# EAGLE design test_strip_v0.1_r1.1 (EAGLE 7.7.0)
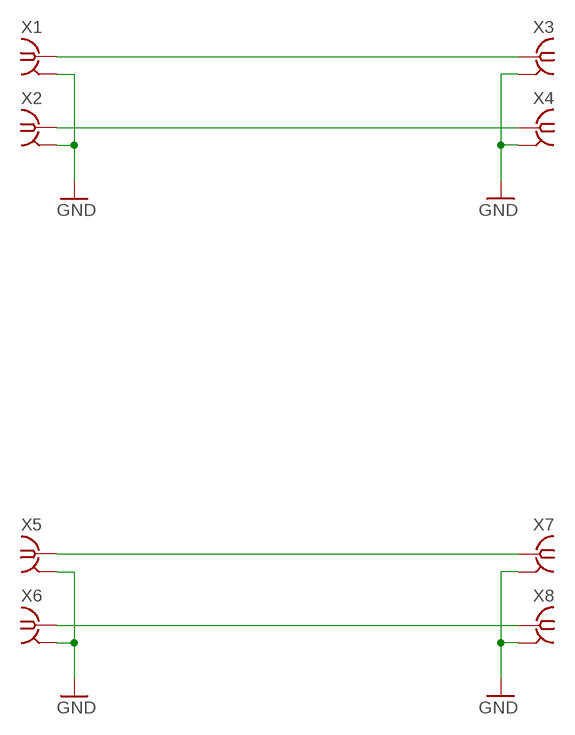
[diagram p0: schematic, sheet 1]

## Parts
X1  BU-SMA-E-ND  [SMA-EDGE_ND]
X2  BU-SMA-E-ND  [SMA-EDGE_ND]
X3  BU-SMA-E-ND  [SMA-EDGE_ND]
X4  BU-SMA-E-ND  [SMA-EDGE_ND]
X5  BU-SMA-E-ND  [SMA-EDGE_ND]
X6  BU-SMA-E-ND  [SMA-EDGE_ND]
X7  BU-SMA-E-ND  [SMA-EDGE_ND]
X8  BU-SMA-E-ND  [SMA-EDGE_ND]

## Nets
GND: X1.2@3 X1.2@4 X2.2@3 X2.2@4 X3.2@3 X3.2@4 X4.2@3 X4.2@4 X5.2@3 X5.2@4 X6.2@3 X6.2@4 X7.2@3 X7.2@4 X8.2@3 X8.2@4
SIGA_N: X2.1 X4.1
SIGA_P: X1.1 X3.1
SIGB_N: X6.1 X8.1
SIGB_P: X5.1 X7.1

## Library data of the parts
X1-X8 = sma:BU-SMA-E

## Net classes
0 default: width 0.152 mm, drill 0.203 mm, clearance 0.152 mm

## Board
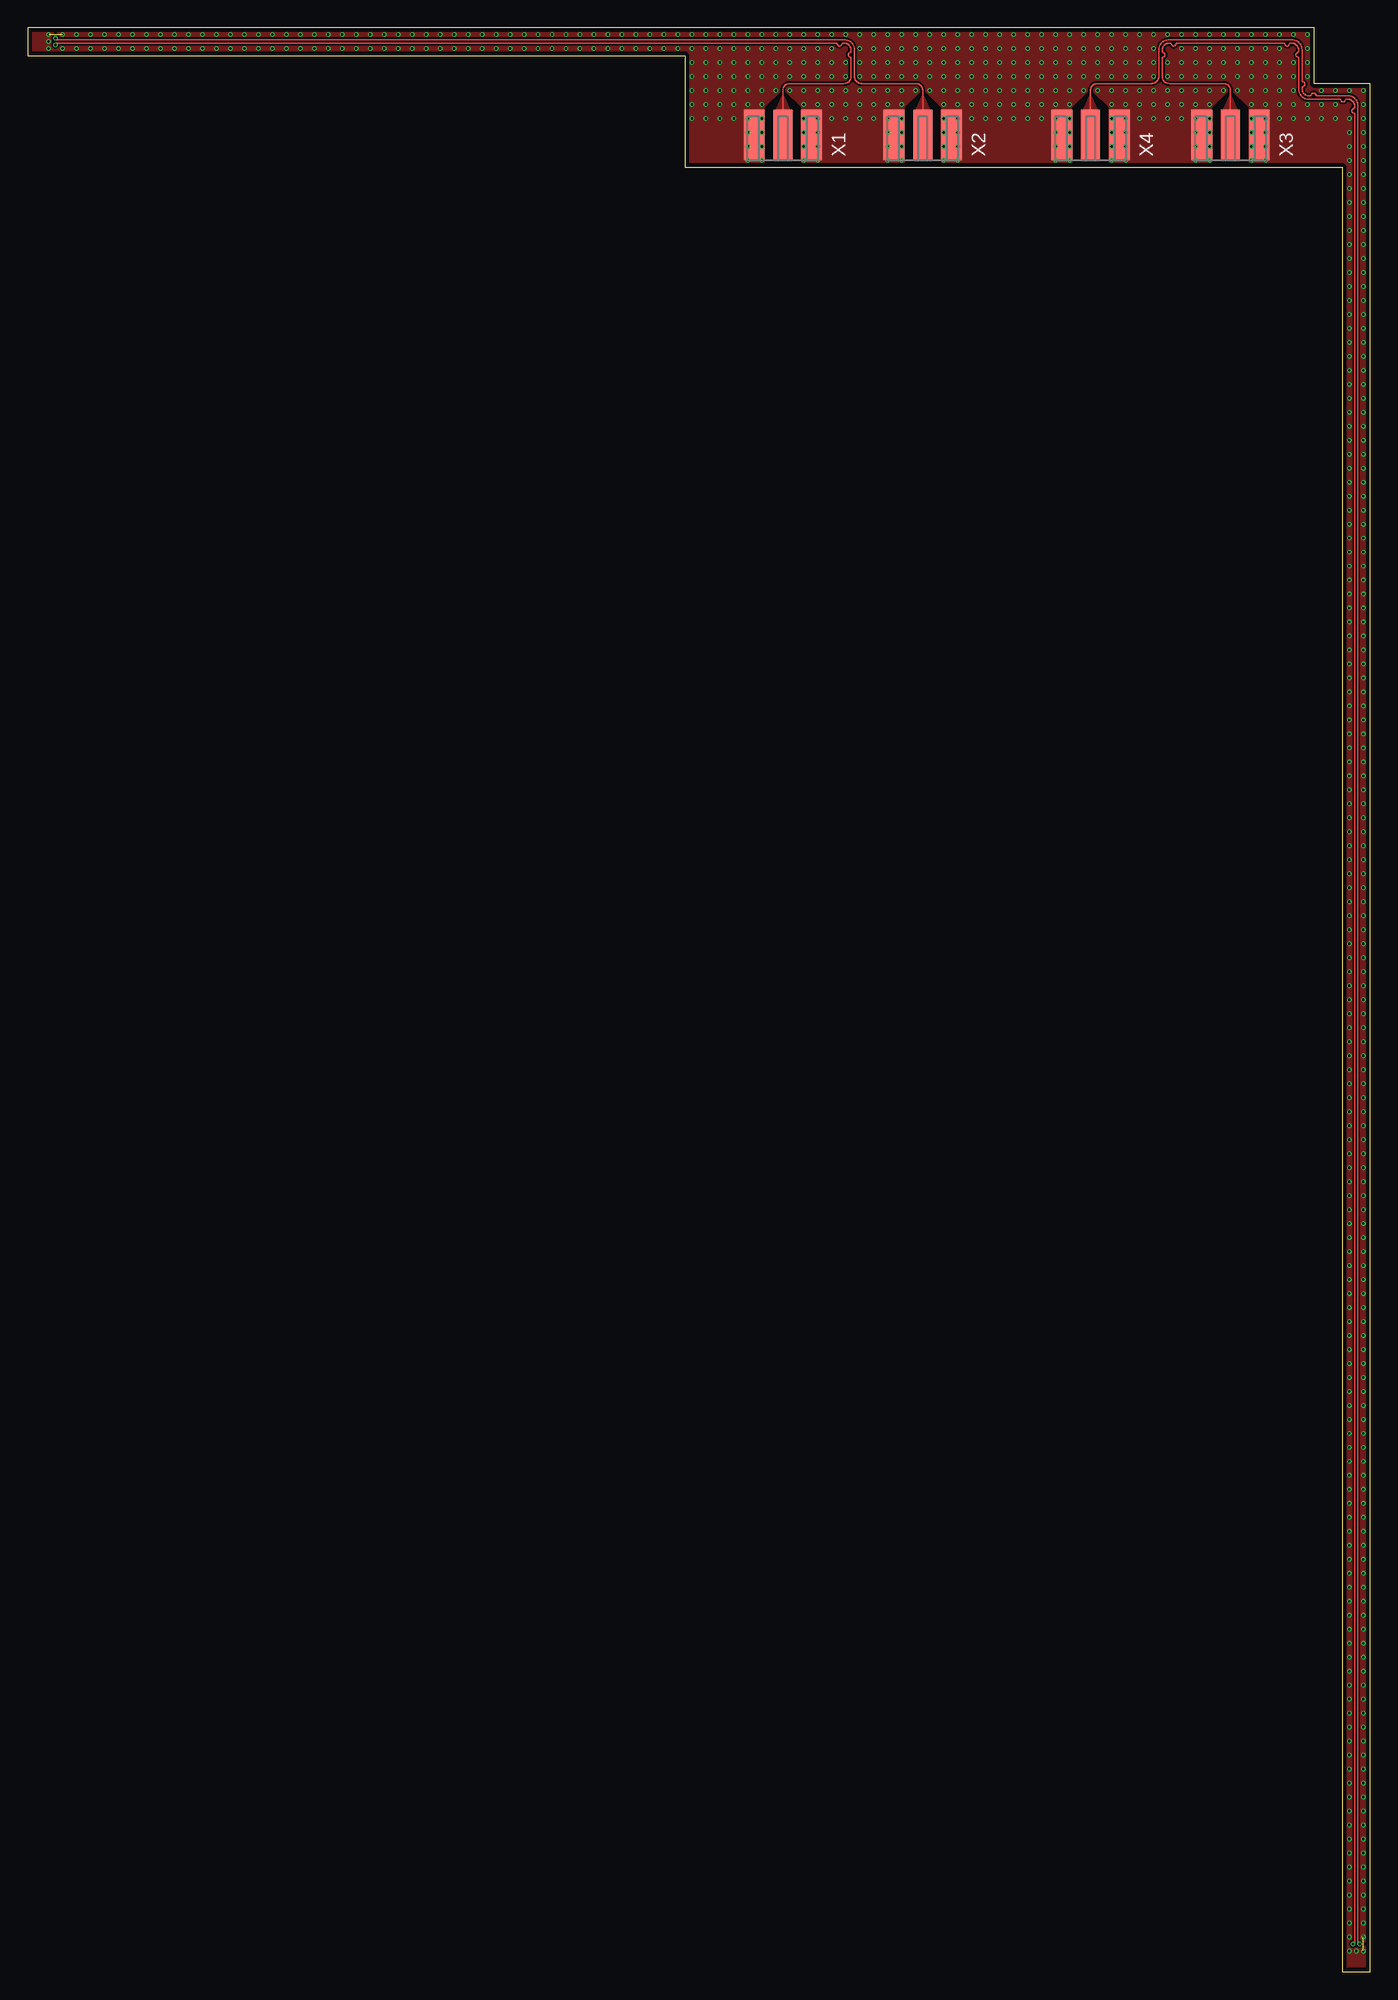
[diagram p1: board, top side]
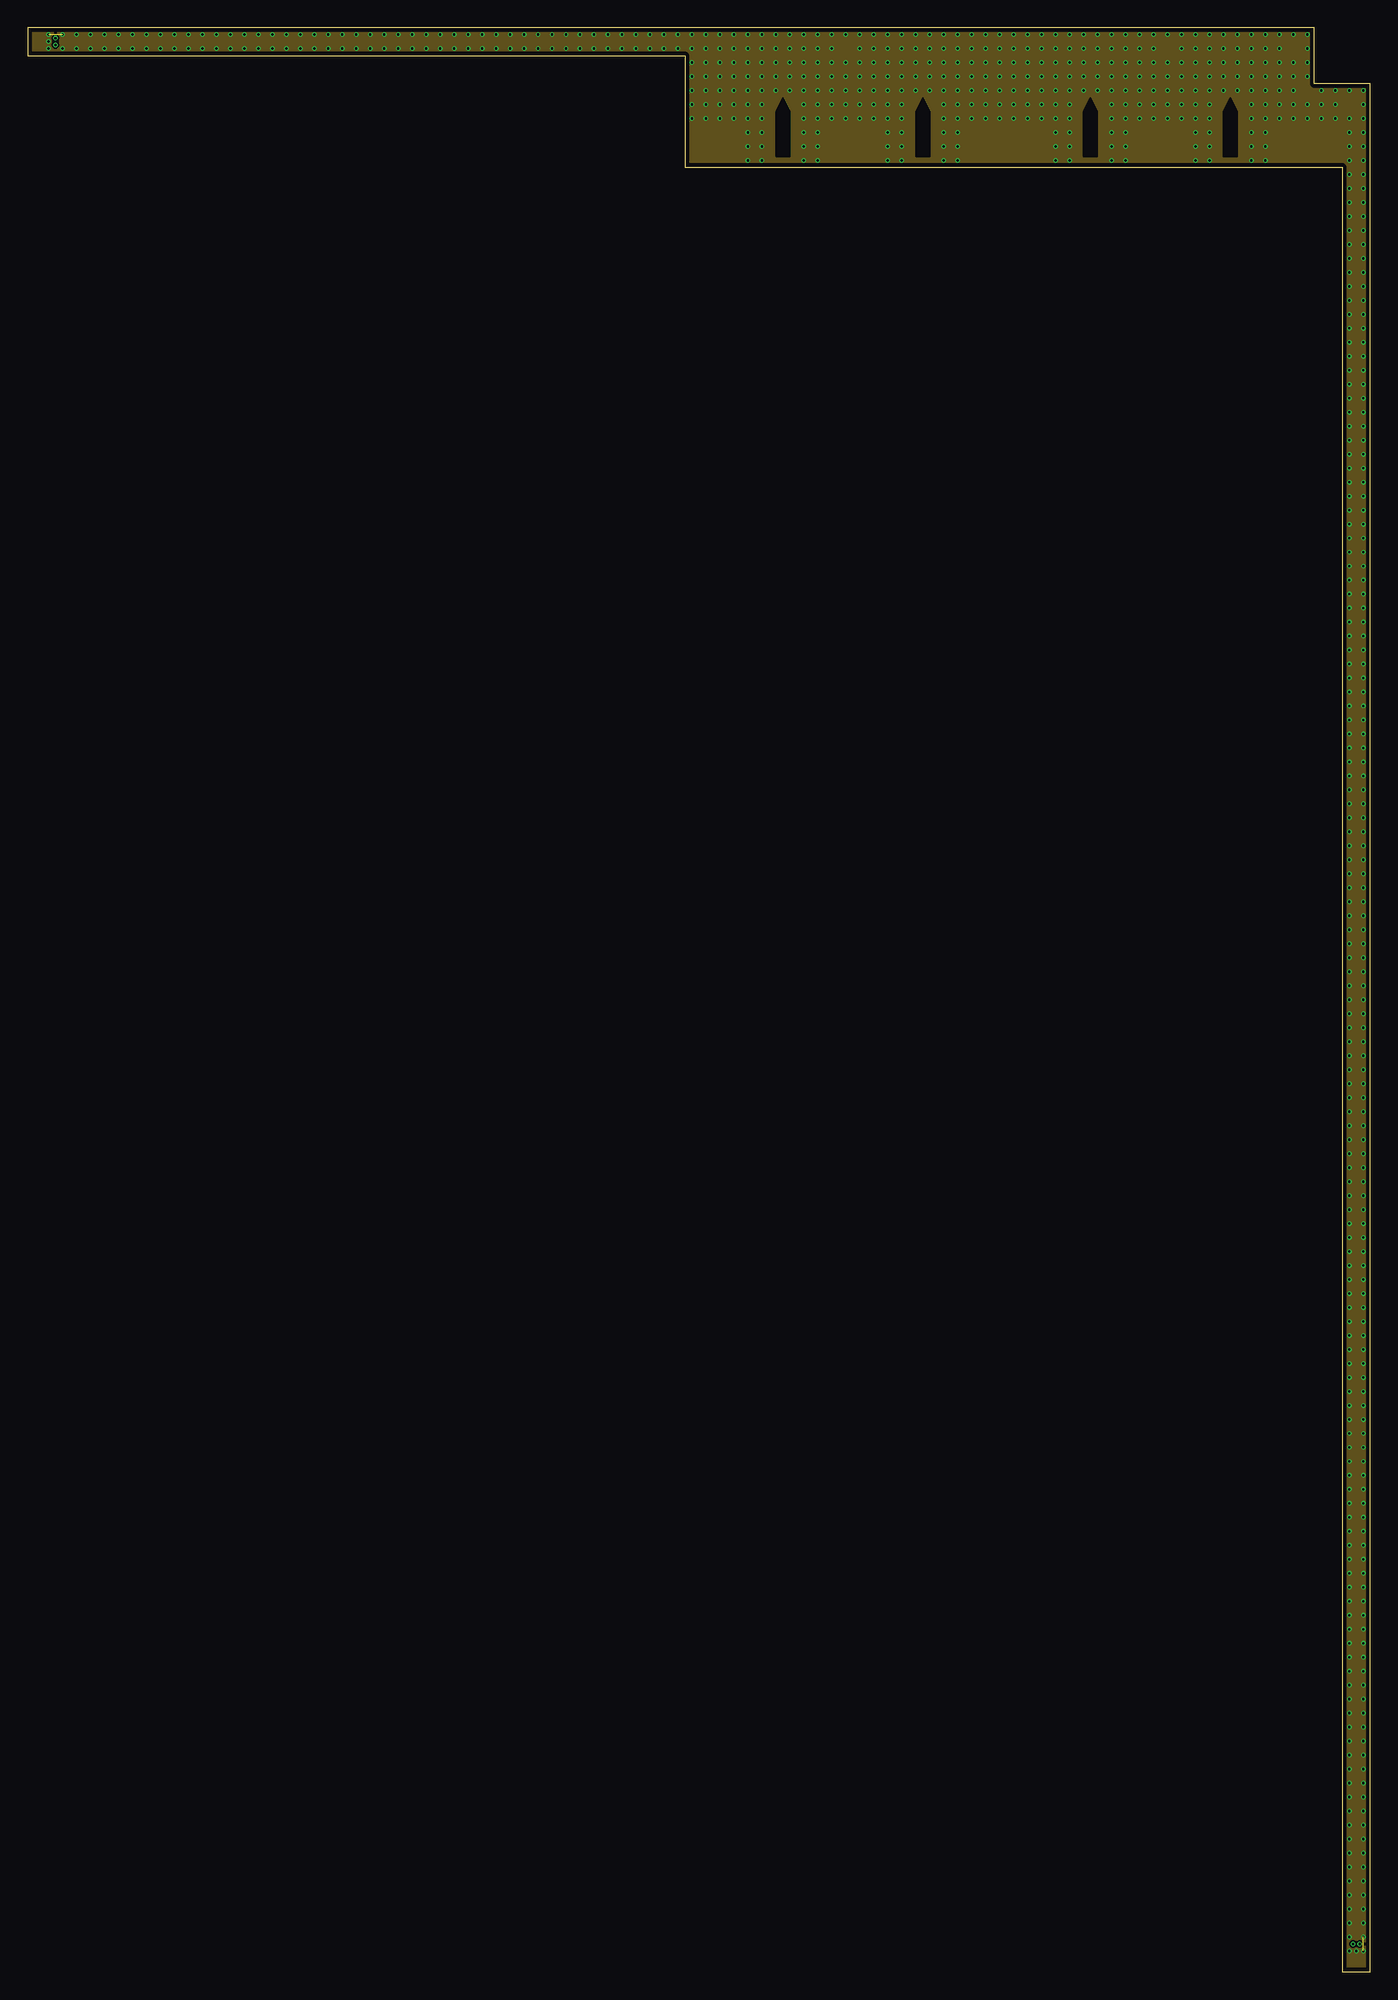
[diagram p2: board, inner layer Route2]
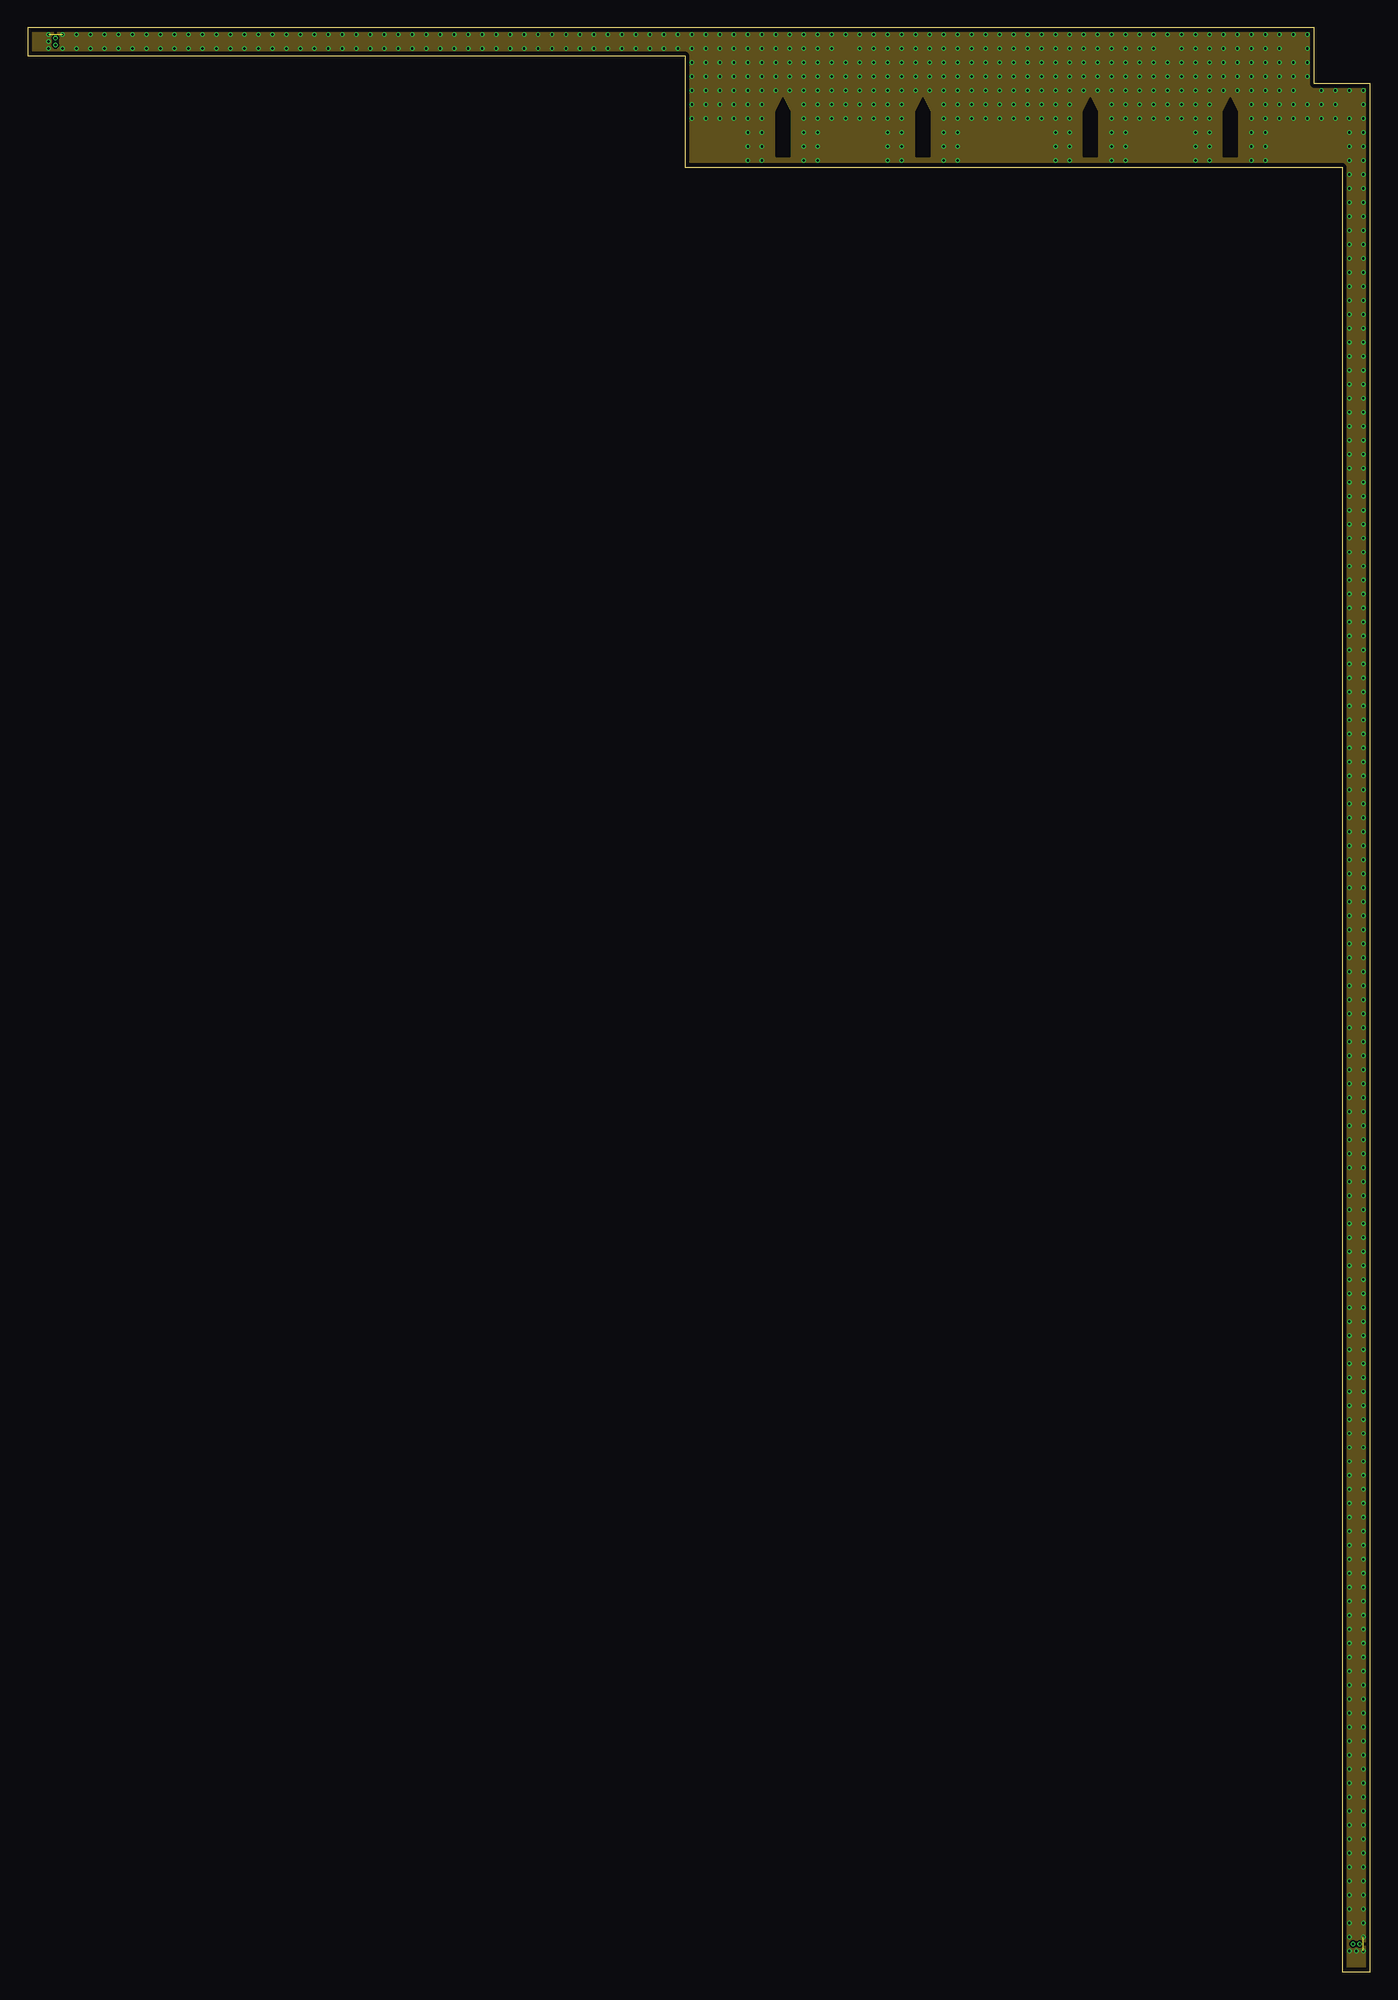
[diagram p3: board, inner layer Route15]
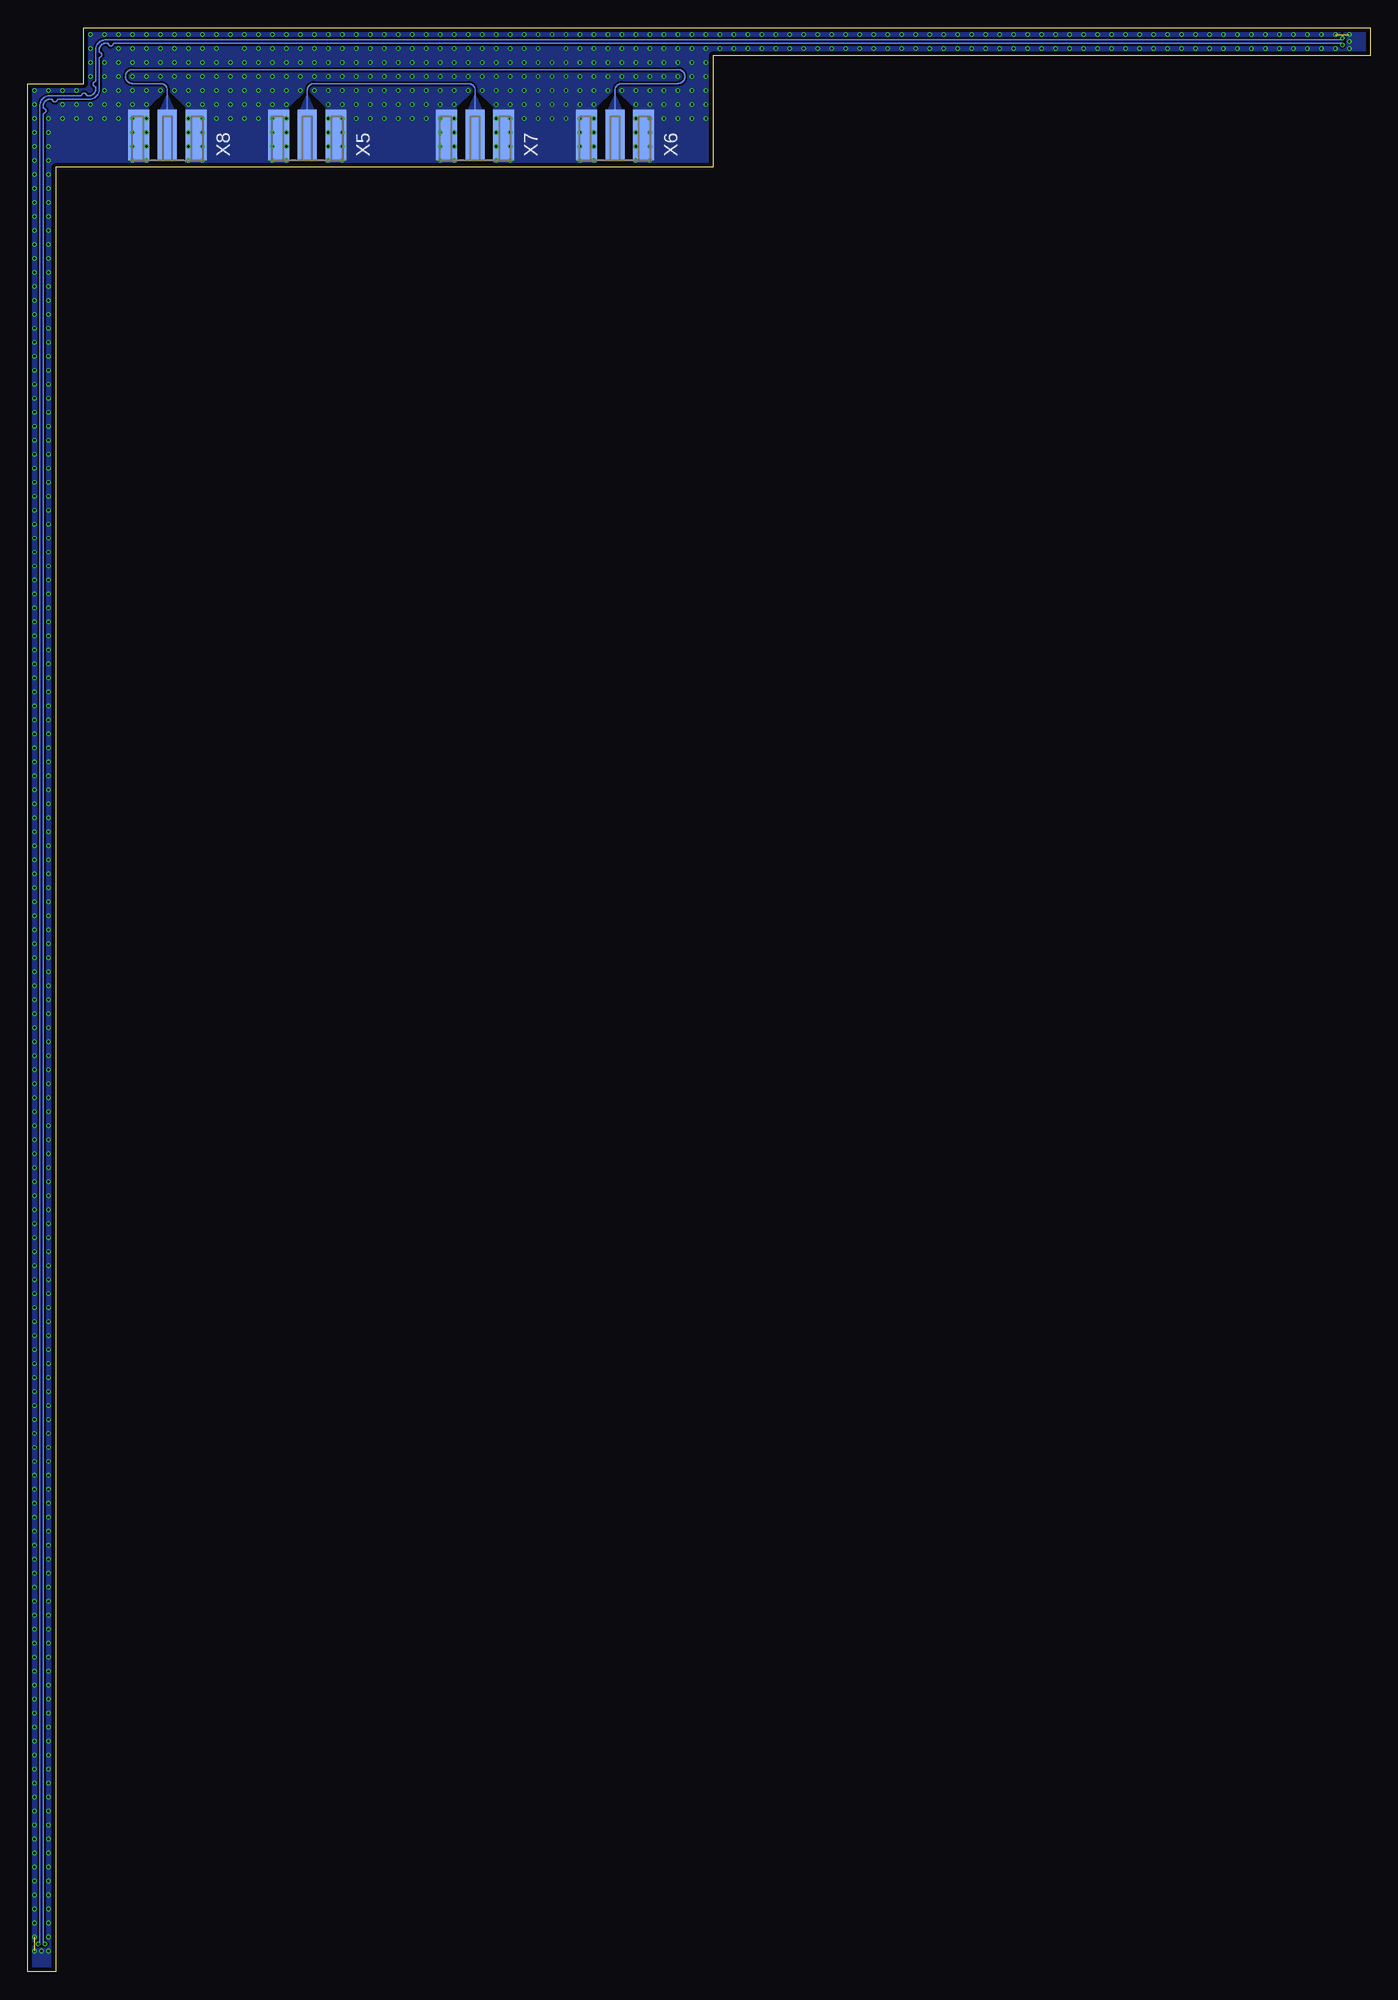
[diagram p4: board, bottom side, seen from below]

Size 121.92 x 176.53 mm. Coordinates in mm from the lower left corner, seen from the top.
Outline: 0,176.53 0,173.99 59.69,173.99 59.69,163.83 119.38,163.83 119.38,0 121.92,0 121.92,171.45 116.84,171.45 116.84,176.53 0,176.53
Copper layers (1*2*15*16): Top 0.035559375mm / dielectric 0.17018125mm / Route2 0.01778125mm / dielectric 47mil / Route15 0.01778125mm / dielectric 0.17018125mm / Bottom 0.035559375mm
Design rules "OSHPark-4layer-tuned *": minimum track width 5mil, minimum drill 10mil, track to track 5mil, track to pad 5mil, pad to pad 5mil, via to via 5mil, smd to smd 5mil, copper to edge 15mil, drill to drill 6mil, minimum pad ring 4mil, minimum via ring 4mil, stop-mask expansion 2mil, vias tented up to drill 10mil, thermal gap 6mil

### Footprints (pad centres in the part's own frame; a part is rotated, then mirrored left to right if it is on the bottom)
SMA-EDGE_ND = smd 4.6 x 1.73: 1 -2.3,0 | smd 4.6 x 1.9: 2@3 -2.3,-2.6; 2@4 -2.3,2.6

### Placement (x,y rotation side)
X1  68.58,164.46 270 top
X2  81.28,164.46 270 top
X3  109.22,164.46 270 top
X4  96.52,164.46 270 top
X5  96.52,164.46 270 bottom
X6  68.58,164.46 270 bottom
X7  81.28,164.46 270 bottom
X8  109.22,164.46 270 bottom

### Tracks (layer width: path | path; a pad name or v marks a point on that pad's centre or on a via)
GND  (via drill 0.2)  (2 unrouted)
  other vias: 3.17,175.89 3.17,174.62 4.45,174.62 5.72,174.62 6.98,174.62 6.98,175.89 5.72,175.89 4.45,175.89 8.25,175.89 8.25,174.62 9.53,174.62 10.8,174.62 12.06,174.62 12.06,175.89 10.8,175.89 9.53,175.89 13.33,175.89 13.33,174.62 14.61,174.62 15.88,174.62 17.14,174.62 17.14,175.89 15.88,175.89 14.61,175.89 18.42,175.89 18.42,174.62 19.69,174.62 20.95,174.62 22.22,174.62 22.22,175.89 20.95,175.89 19.69,175.89 23.5,175.89 23.5,174.62 24.77,174.62 26.04,174.62 27.3,174.62 27.3,175.89 26.04,175.89 24.77,175.89 28.58,175.89 28.58,174.62 29.84,174.62 31.12,174.62 32.38,174.62 32.38,175.89 31.12,175.89 29.84,175.89 33.66,175.89 33.66,174.62 34.92,174.62 36.2,174.62 37.47,174.62 37.47,175.89 36.2,175.89 34.92,175.89 38.73,175.89 38.73,174.62 40.01,174.62 41.27,174.62 42.55,174.62 42.55,175.89 41.27,175.89 40.01,175.89 43.81,175.89 43.81,174.62 45.09,174.62 46.36,174.62 47.62,174.62 47.62,175.89 46.36,175.89 45.09,175.89 48.9,175.89 48.9,174.62 50.16,174.62 51.44,174.62 52.7,174.62 52.7,175.89 51.44,175.89 50.16,175.89 53.98,175.89 53.98,174.62 55.24,174.62 56.52,174.62 57.78,174.62 57.78,175.89 56.52,175.89 55.24,175.89 59.05,175.89 59.05,174.62 60.33,174.62 61.59,174.62 62.87,174.62 62.87,175.89 61.59,175.89 60.33,175.89 1.91,175.89 1.91,174.62 1.91,175.26 121.28,132.71 120.02,132.71 120.02,133.98 121.28,133.98 121.28,135.25 121.28,136.52 121.28,137.79 120.02,137.79 120.02,136.52 120.02,135.25 120.02,139.06 121.28,139.06 121.28,140.33 121.28,141.6 121.28,142.88 120.02,142.88 120.02,141.6 120.02,140.33 120.02,144.14 121.28,144.14 121.28,145.41 121.28,146.69 121.28,147.95 120.02,147.95 120.02,146.69 120.02,145.41 120.02,149.22 121.28,149.22 121.28,150.49 121.28,151.76 121.28,153.03 120.02,153.03 120.02,151.76 120.02,150.49 120.02,154.3 121.28,154.3 121.28,155.57 121.28,156.84 121.28,158.11 120.02,158.11 120.02,156.84 120.02,155.57 120.02,159.38 121.28,159.38 121.28,160.65 121.28,161.92 121.28,163.19 120.02,163.19 120.02,161.92 120.02,160.65 120.02,164.46 121.28,164.46 121.28,165.73 121.28,167 121.28,168.27 120.02,168.27 120.02,167 120.02,165.73 120.02,71.75 121.28,71.75 121.28,73.02 121.28,74.29 121.28,75.56 120.02,75.56 120.02,74.29 120.02,73.02 120.02,76.83 121.28,76.83 121.28,78.1 121.28,79.37 121.28,80.64 120.02,80.64 120.02,79.37 120.02,78.1 120.02,81.91 121.28,81.91 121.28,83.18 121.28,84.45 121.28,85.72 120.02,85.72 120.02,84.45 120.02,83.18 120.02,86.99 121.28,86.99 121.28,88.26 121.28,89.53 121.28,90.8 120.02,90.8 120.02,89.53 120.02,88.26 120.02,92.07 121.28,92.07 121.28,93.34 121.28,94.61 121.28,95.88 120.02,95.88 120.02,94.61 120.02,93.34 120.02,97.15 121.28,97.15 121.28,98.42 121.28,99.69 121.28,100.96 120.02,100.96 120.02,99.69 120.02,98.42 120.02,102.23 121.28,102.23 121.28,103.5 121.28,104.77 121.28,106.04 120.02,106.04 120.02,104.77 120.02,103.5 120.02,107.31 121.28,107.31 121.28,108.58 121.28,109.85 121.28,111.12 120.02,111.12 120.02,109.85 120.02,108.58 120.02,112.39 121.28,112.39 121.28,113.66 121.28,114.93 121.28,116.2 120.02,116.2 120.02,114.93 120.02,113.66 120.02,117.47 121.28,117.47 121.28,118.74 121.28,120.01 121.28,121.28 120.02,121.28 120.02,120.01 120.02,118.74 120.02,122.55 121.28,122.55 121.28,123.82 121.28,125.09 121.28,126.36 120.02,126.36 120.02,125.09 120.02,123.82 120.02,127.63 121.28,127.63 121.28,128.9 121.28,130.17 121.28,131.44 120.02,131.44 120.02,130.17 120.02,128.9 120.02,3.17 121.28,3.17 121.28,12.06 121.28,13.33 121.28,14.6 120.02,14.6 120.02,13.33 120.02,12.06 120.02,15.88 121.28,15.88 121.28,17.14 121.28,18.41 121.28,19.68 120.02,19.68 120.02,18.41 120.02,17.14 120.02,20.95 121.28,20.95 121.28,22.22 121.28,23.49 121.28,24.76 120.02,24.76 120.02,23.49 120.02,22.22 120.02,26.03 121.28,26.03 121.28,27.3 121.28,28.57 121.28,29.84 120.02,29.84 120.02,28.57 120.02,27.3 120.02,31.11 121.28,31.11 121.28,32.38 121.28,33.65 121.28,34.92 120.02,34.92 120.02,33.65 120.02,32.38 120.02,36.19 121.28,36.19 121.28,37.46 121.28,38.73 121.28,40 120.02,40 120.02,38.73 120.02,37.46 120.02,41.27 121.28,41.27 121.28,42.54 121.28,43.81 121.28,45.08 120.02,45.08 120.02,43.81 120.02,42.54 120.02,46.35 121.28,46.35 121.28,47.62 121.28,48.89 121.28,50.16 120.02,50.16 120.02,48.89 120.02,47.62 120.02,51.43 121.28,51.43 121.28,52.7 121.28,53.97 121.28,55.24 120.02,55.24 120.02,53.97 120.02,52.7 120.02,56.51 121.28,56.51 121.28,57.78 121.28,59.05 121.28,60.32 120.02,60.32 120.02,59.05 120.02,57.78 120.02,61.59 121.28,61.59 121.28,62.86 121.28,64.13 121.28,65.4 120.02,65.4 120.02,64.13 120.02,62.86 120.02,66.67 121.28,66.67 121.28,67.94 121.28,69.21 121.28,70.48 120.02,70.48 120.02,69.21 120.02,67.94 120.02,1.9 121.28,1.9 120.65,1.9 106.05,174.62 106.05,175.89 107.31,175.89 107.31,174.62 108.59,174.62 109.86,174.62 111.12,174.62 111.12,175.89 109.86,175.89 108.59,175.89 112.39,175.89 112.39,174.62 113.66,174.62 116.2,174.62 116.2,175.89 114.94,175.89 113.66,175.89 114.94,173.35 114.94,172.08 114.94,170.81 114.94,169.54 117.47,169.54 116.2,169.54 118.75,169.54 118.75,170.81 117.47,170.81 116.2,173.35 116.2,172.08 64.14,174.62 64.14,175.89 65.41,175.89 65.41,174.62 66.67,174.62 67.94,174.62 69.22,174.62 69.22,175.89 67.94,175.89 66.67,175.89 70.48,175.89 70.48,174.62 71.75,174.62 73.03,174.62 74.3,175.89 73.03,175.89 71.75,175.89 75.56,175.89 75.56,174.62 76.84,174.62 78.11,174.62 79.38,174.62 79.38,175.89 78.11,175.89 76.84,175.89 80.64,175.89 80.64,174.62 81.92,174.62 83.19,174.62 84.45,174.62 84.45,175.89 83.19,175.89 81.92,175.89 85.72,175.89 85.72,174.62 87,174.62 88.27,174.62 89.53,174.62 89.53,175.89 88.27,175.89 87,175.89 90.81,175.89 90.81,174.62 92.08,174.62 93.34,174.62 94.61,174.62 94.61,175.89 93.34,175.89 92.08,175.89 95.89,175.89 95.89,174.62 97.16,174.62 98.42,174.62 99.69,174.62 99.69,175.89 98.42,175.89 97.16,175.89 100.97,175.89 100.97,174.62 102.23,174.62 104.78,174.62 104.78,175.89 103.5,175.89 102.23,175.89 121.28,169.54 121.28,170.81 120.02,170.81 95.89,172.08 97.16,172.08 97.16,173.35 95.89,173.35 98.42,173.35 98.42,172.08 99.69,172.08 100.97,172.08 102.23,173.35 100.97,173.35 99.69,173.35 103.5,173.35 103.5,172.08 104.78,172.08 106.05,172.08 107.31,172.08 107.31,173.35 106.05,173.35 104.78,173.35 108.59,173.35 109.86,172.08 109.86,173.35 70.48,170.81 71.75,170.81 73.03,170.81 75.56,170.81 76.84,170.81 78.11,170.81 79.38,170.81 67.94,172.08 69.22,173.35 67.94,173.35 70.48,173.35 70.48,172.08 71.75,172.08 73.03,172.08 74.3,173.35 73.03,173.35 71.75,173.35 75.56,173.35 75.56,172.08 76.84,172.08 78.11,172.08 79.38,172.08 79.38,173.35 78.11,173.35 76.84,173.35 80.64,173.35 80.64,172.08 81.92,172.08 81.92,173.35 98.42,170.81 99.69,170.81 100.97,170.81 103.5,170.81 104.78,170.81 106.05,170.81 107.31,170.81 111.12,173.35 112.39,173.35 113.66,173.35 113.66,172.08 113.66,170.81 112.39,170.81 111.12,170.81 111.12,172.08 112.39,172.08 66.67,173.35 65.41,173.35 64.14,173.35 62.87,173.35 61.59,173.35 61.59,172.08 61.59,170.81 62.87,170.81 64.14,170.81 65.41,170.81 66.67,170.81 66.67,172.08 65.41,172.08 64.14,172.08 62.87,172.08 66.67,169.54 66.67,168.27 66.67,167 66.67,165.73 70.48,165.73 70.48,167 70.48,168.27 70.48,169.54 79.38,169.54 79.38,168.27 79.38,167 79.38,165.73 83.19,170.81 83.19,169.54 83.19,168.27 83.19,167 83.19,165.73 81.92,170.81 80.64,170.81 69.22,170.81 67.94,170.81 74.3,172.08 74.3,170.81 83.19,172.08 83.19,173.35 95.89,170.81 97.16,170.81 94.61,173.35 94.61,172.08 94.61,170.81 94.61,169.54 94.61,168.27 94.61,167 94.61,165.73 98.42,169.54 98.42,168.27 98.42,167 98.42,165.73 99.69,169.54 99.69,168.27 99.69,167 99.69,165.73 93.34,173.35 93.34,172.08 93.34,170.81 93.34,168.27 93.34,169.54 93.34,167 93.34,165.73 65.41,169.54 65.41,168.27 65.41,167 65.41,165.73 65.41,164.46 66.67,164.46 70.48,164.46 71.75,164.46 71.75,165.73 71.75,167 71.75,168.27 71.75,169.54 78.11,164.46 79.38,164.46 78.11,165.73 78.11,167 78.11,168.27 78.11,169.54 83.19,164.46 84.45,164.46 84.45,165.73 84.45,167 84.45,168.27 84.45,169.54 84.45,170.81 84.45,172.08 84.45,173.35 94.61,164.46 93.34,164.46 98.42,164.46 99.69,164.46 107.31,169.54 107.31,168.27 107.31,167 107.31,165.73 107.31,164.46 106.05,164.46 106.05,165.73 106.05,167 106.05,168.27 106.05,169.54 108.59,170.81 109.86,170.81 111.12,169.54 111.12,167 111.12,168.27 111.12,165.73 111.12,164.46 112.39,164.46 112.39,165.73 112.39,167 112.39,168.27 112.39,169.54 102.23,172.08 69.22,172.08 92.08,172.08 90.81,172.08 89.53,172.08 85.72,172.08 87,172.08 88.27,172.08 85.72,173.35 87,173.35 88.27,173.35 92.08,173.35 90.81,173.35 89.53,173.35 92.08,170.81 90.81,170.81 89.53,170.81 85.72,170.81 87,170.81 88.27,170.81 102.23,170.81 108.59,172.08 61.59,169.54 61.59,168.27 60.33,173.35 60.33,172.08 60.33,170.81 60.33,169.54 60.33,168.27 62.87,168.27 64.14,168.27 62.87,169.54 64.14,169.54 73.03,169.54 73.03,168.27 74.3,168.27 75.56,168.27 76.84,168.27 74.3,169.54 75.56,169.54 76.84,169.54 85.72,169.54 85.72,168.27 87,168.27 87,169.54 88.27,169.54 88.27,168.27 89.53,168.27 89.53,169.54 90.81,169.54 90.81,168.27 92.08,168.27 92.08,169.54 100.97,169.54 100.97,168.27 102.23,168.27 102.23,169.54 103.5,169.54 103.5,168.27 104.78,169.54 104.78,168.27 113.66,168.27 113.66,169.54 114.94,168.27 116.2,168.27 117.47,168.27 118.75,168.27 121.28,6.98 121.28,8.25 120.02,8.25 120.02,6.98 120.02,9.52 121.28,9.52 121.28,10.79 120.02,10.79 120.02,5.71 121.28,5.71 120.02,4.44 121.28,4.44
  pour Top (rank 3, no thermals): 0,176.53 116.84,176.53 116.84,171.45 121.92,171.45 121.92,0 119.38,0 119.38,163.83 59.69,163.83 59.69,173.99 0,173.99
  cutout Top (rank 3): 66.99,164.15 66.99,169.23 68.58,170.81 70.17,169.23 70.17,164.15 69.53,164.15 69.53,169.54 68.58,170.69 67.63,169.54 67.63,164.15
  cutout Top (rank 3): 79.69,164.15 79.69,169.23 81.28,170.81 82.87,169.23 82.87,164.15 82.23,164.15 82.23,169.54 81.28,170.69 80.33,169.54 80.33,164.15
  cutout Top (rank 3): 94.93,164.15 94.93,169.23 96.52,170.81 98.11,169.23 98.11,164.15 97.47,164.15 97.47,169.54 96.52,170.69 95.57,169.54 95.57,164.15
  cutout Top (rank 3): 107.63,164.15 107.63,169.23 109.22,170.81 110.81,169.23 110.81,164.15 110.17,164.15 110.17,169.54 109.22,170.69 108.27,169.54 108.27,164.15
  pour Bottom (no thermals): 0,176.53 116.84,176.53 116.84,171.45 121.92,171.45 121.92,0 119.38,0 119.38,163.83 59.69,163.83 59.69,173.99 0,173.99
  cutout Bottom (rank 3): 66.99,164.15 66.99,169.23 68.58,170.81 70.17,169.23 70.17,164.15 69.53,164.15 69.53,169.54 68.58,170.69 67.63,169.54 67.63,164.15
  cutout Bottom (rank 3): 79.69,164.15 79.69,169.23 81.28,170.81 82.87,169.23 82.87,164.15 82.23,164.15 82.23,169.54 81.28,170.69 80.33,169.54 80.33,164.15
  cutout Bottom (rank 3): 94.93,164.15 94.93,169.23 96.52,170.81 98.11,169.23 98.11,164.15 97.47,164.15 97.47,169.54 96.52,170.69 95.57,169.54 95.57,164.15
  cutout Bottom (rank 3): 107.63,164.15 107.63,169.23 109.22,170.81 110.81,169.23 110.81,164.15 110.17,164.15 110.17,169.54 109.22,170.69 108.27,169.54 108.27,164.15
  pour Route2 (no thermals): 0,176.53 116.84,176.53 116.84,171.45 121.92,171.45 121.92,0 119.38,0 119.38,163.83 59.69,163.83 59.69,173.99 0,173.99
  pour Route15 (no thermals): 0,176.53 116.84,176.53 116.84,171.45 121.92,171.45 121.92,0 119.38,0 119.38,163.83 59.69,163.83 59.69,173.99 0,173.99
  cutout Route2 (rank 3): 69.22,164.78 69.22,168.91 68.58,170.18 67.94,168.91 67.94,164.78
  cutout Route2 (rank 3): 81.92,164.78 81.92,168.91 81.28,170.18 80.64,168.91 80.64,164.78
  cutout Route2 (rank 3): 97.16,164.78 97.16,168.91 96.52,170.18 95.89,168.91 95.89,164.78
  cutout Route2 (rank 3): 109.86,164.78 109.86,168.91 109.22,170.18 108.59,168.91 108.59,164.78
  cutout Route15 (rank 2): 69.22,164.78 69.22,168.91 68.58,170.18 67.94,168.91 67.94,164.78
  cutout Route15 (rank 3): 81.92,164.78 81.92,168.91 81.28,170.18 80.64,168.91 80.64,164.78
  cutout Route15 (rank 2): 97.16,164.78 97.16,168.91 96.52,170.18 95.89,168.91 95.89,164.78
  cutout Route15 (rank 3): 109.86,164.78 109.86,168.91 109.22,170.18 108.59,168.91 108.59,164.78
SIGA_N  (via drill 0.2)
  Top 0.152: X2.1 81.28,170.81 arc90 80.64,171.45 75.72,171.45 arc-90 75.08,172.08 75.08,174.52 arc90 74.19,175.41 2.69,175.41 arc-90 v2.54,175.56 | X4.1 96.52,170.81 arc-90 97.16,171.45 102.08,171.45 arc90 102.72,172.08 102.72,174.52 arc-90 103.61,175.41 114.83,175.41 arc-90 115.72,174.52 115.72,171.72 arc63 115.79,171.6 115.91,171.55 arc-63 115.98,171.43 115.98,171.34 arc-63 115.91,171.22 115.79,171.17 arc63 115.72,171.05 115.72,170.97 arc90 116.36,170.33 116.44,170.33 arc63 116.56,170.4 116.61,170.52 arc-63 116.73,170.59 116.83,170.59 arc-63 116.94,170.52 117,170.4 arc63 117.11,170.33 119.91,170.33 arc-90 120.8,169.44 120.8,2.69 arc90 v120.95,2.54
  Bottom 0.152: v2.54,175.56 arc90 2.69,175.41 114.83,175.41 arc-90 115.72,174.52 115.72,171.72 arc63 115.79,171.6 115.91,171.55 arc-63 115.98,171.43 115.98,171.34 arc-63 115.91,171.22 115.79,171.17 arc63 115.72,171.05 115.72,170.97 arc90 116.36,170.33 116.44,170.33 arc63 116.56,170.4 116.61,170.52 arc-63 116.73,170.59 116.83,170.59 arc-63 116.94,170.52 117,170.4 arc63 117.11,170.33 119.91,170.33 arc-90 120.8,169.44 120.8,2.69 arc90 v120.95,2.54
  pour Top (rank 2, no thermals): 81.92,169.04 81.28,170.43 80.64,169.04 80.64,164.78 81.92,164.78
  pour Top (rank 2, no thermals): 97.16,169.04 96.52,170.43 95.89,169.04 95.89,164.78 97.16,164.78
SIGA_P  (via drill 0.2)
  Top 0.152: X1.1 68.58,170.81 arc-90 69.22,171.45 74.14,171.45 arc90 74.78,172.08 74.78,173.72 arc63 74.71,173.83 74.59,173.89 arc-63 74.52,174 74.52,174.1 arc-63 74.59,174.22 74.71,174.27 arc63 74.78,174.39 74.78,174.47 arc90 74.14,175.11 74.06,175.11 arc63 73.94,175.04 73.89,174.92 arc-63 73.77,174.85 73.67,174.85 arc-63 73.56,174.92 73.5,175.04 arc63 73.39,175.11 2.69,175.11 arc90 v2.54,174.95 | X3.1 109.22,170.81 arc90 108.59,171.45 103.66,171.45 arc-90 103.02,172.08 103.02,173.72 arc-63 103.09,173.83 103.21,173.89 arc63 103.28,174 103.28,174.1 arc63 103.21,174.22 103.09,174.27 arc-63 103.02,174.39 103.02,174.47 arc-90 103.66,175.11 103.74,175.11 arc-63 103.86,175.04 103.91,174.92 arc63 104.03,174.85 104.12,174.85 arc63 104.24,174.92 104.3,175.04 arc-63 104.41,175.11 114.03,175.11 arc-63 114.14,175.04 114.2,174.92 arc63 114.31,174.85 114.41,174.85 arc63 114.53,174.92 114.58,175.04 arc-63 114.7,175.11 114.78,175.11 arc-90 115.42,174.47 115.42,174.39 arc-63 115.35,174.27 115.23,174.22 arc63 115.16,174.1 115.16,174 arc63 115.23,173.89 115.35,173.83 arc-63 115.42,173.72 115.42,170.92 arc90 116.31,170.03 119.11,170.03 arc-63 119.22,169.96 119.28,169.84 arc63 119.39,169.77 119.49,169.77 arc63 119.61,169.84 119.66,169.96 arc-63 119.78,170.03 119.86,170.03 arc-90 120.5,169.39 120.5,169.31 arc-63 120.43,169.19 120.31,169.14 arc63 120.24,169.02 120.24,168.92 arc63 120.31,168.81 120.43,168.75 arc-63 120.5,168.64 120.5,2.69 arc-90 v120.34,2.54
  Bottom 0.152: v2.54,174.95 arc-90 2.69,175.11 114.03,175.11 arc-63 114.14,175.04 114.2,174.92 arc63 114.31,174.85 114.41,174.85 arc63 114.53,174.92 114.58,175.04 arc-63 114.7,175.11 114.78,175.11 arc-90 115.42,174.47 115.42,174.39 arc-63 115.35,174.27 115.23,174.22 arc63 115.16,174.1 115.16,174 arc63 115.23,173.89 115.35,173.83 arc-63 115.42,173.72 115.42,170.92 arc90 116.31,170.03 119.11,170.03 arc-63 119.22,169.96 119.28,169.84 arc63 119.39,169.77 119.49,169.77 arc63 119.61,169.84 119.66,169.96 arc-63 119.78,170.03 119.86,170.03 arc-90 120.5,169.39 120.5,169.31 arc-63 120.43,169.19 120.31,169.14 arc63 120.24,169.02 120.24,168.92 arc63 120.31,168.81 120.43,168.75 arc-63 120.5,168.64 120.5,2.69 arc-90 v120.34,2.54
  pour Top (rank 2, no thermals): 69.22,169.04 68.58,170.43 67.94,169.04 67.94,164.78 69.22,164.78
  pour Top (rank 2, no thermals): 109.86,169.04 109.22,170.43 108.59,169.04 108.59,164.78 109.86,164.78
SIGB_N
  Bottom 0.152: X6.1 68.58,170.81 arc90 67.94,171.45 62.87,171.45 arc-90 62.23,172.08 arc-90 62.87,172.72 112.39,172.72 arc-90 113.03,172.08 arc-90 112.39,171.45 109.86,171.45 arc90 109.22,170.81 X8.1
  pour Bottom (rank 2, no thermals): 69.22,169.04 68.58,170.43 67.94,169.04 67.94,164.78 69.22,164.78
  pour Bottom (rank 2, no thermals): 109.86,169.04 109.22,170.43 108.59,169.04 108.59,164.78 109.86,164.78
SIGB_P
  Bottom 0.152: X5.1 96.52,170.81 arc90 95.89,171.45 81.92,171.45 arc90 81.28,170.81 X7.1
  pour Bottom (rank 2, no thermals): 81.92,169.04 81.28,170.43 80.64,169.04 80.64,164.78 81.92,164.78
  pour Bottom (rank 2, no thermals): 97.16,169.04 96.52,170.43 95.89,169.04 95.89,164.78 97.16,164.78

### Text on the board
_tsilk: V0.1 / R1.1